# Altium schematic sheet sensors.SchDoc
size A4
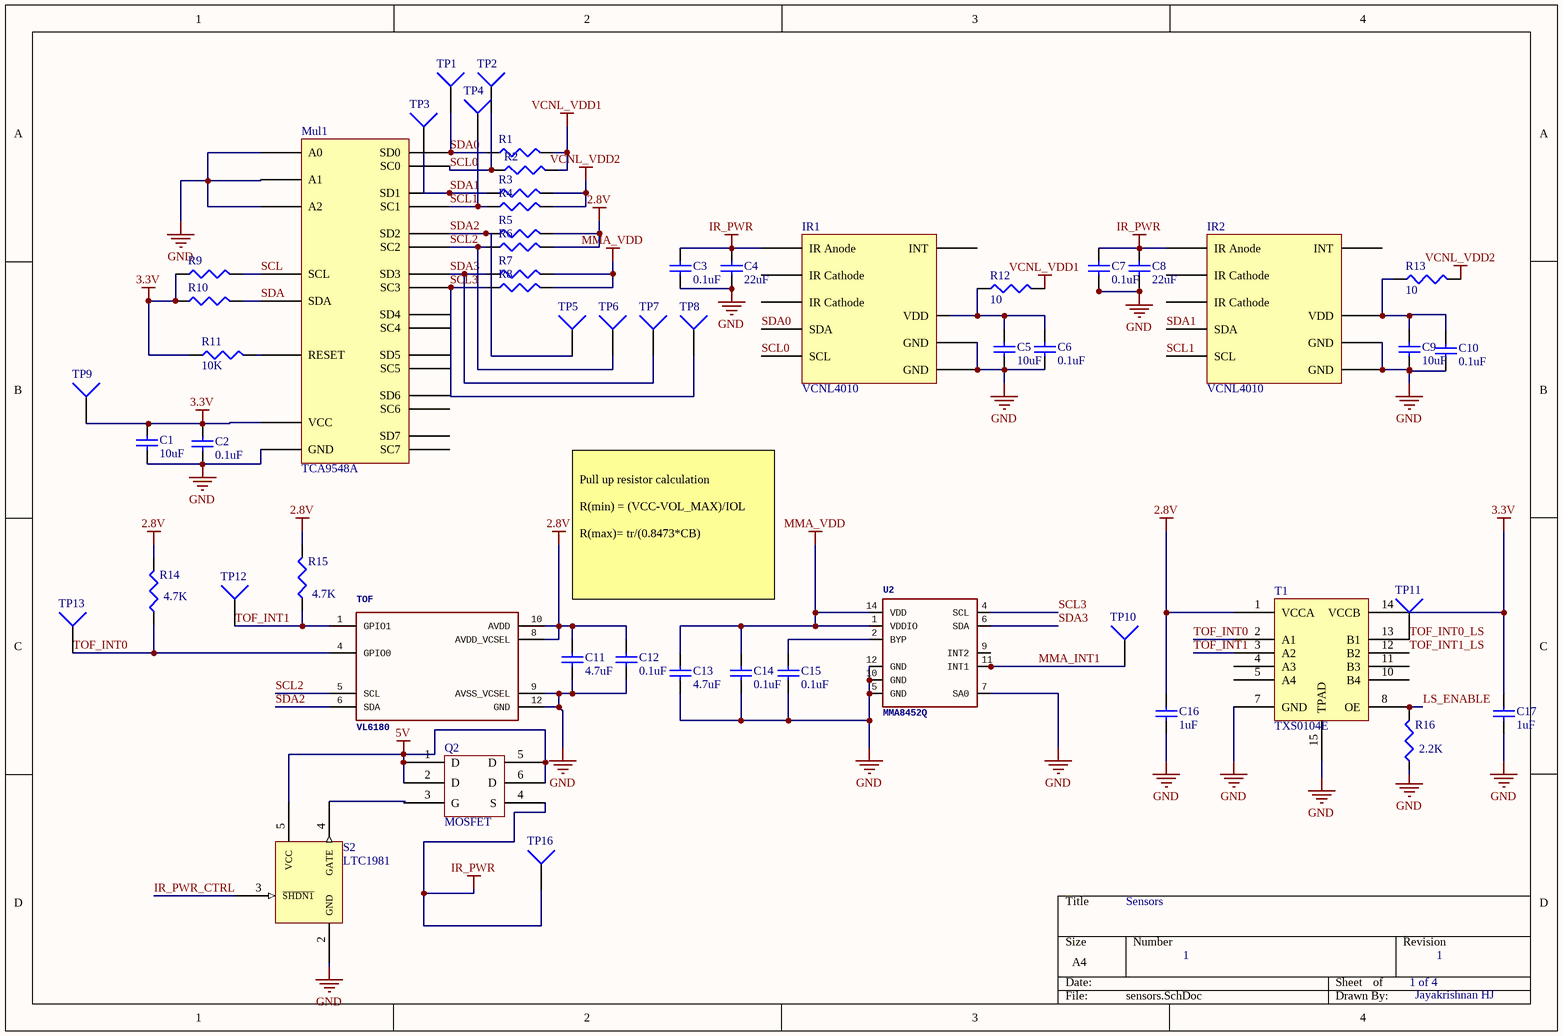
[diagram p0: sensors.SchDoc]

## Parts
C1  value 10uF  [1608[0603]]  (hidden comment: Cap Semi)
C2  value 0.1uF  [1608[0603]]  (hidden comment: Cap Semi)
C3  value 0.1uF  [1608[0603]]  (hidden comment: Cap Semi)
C4  value 22uF  [1608[0603]]  (hidden comment: Cap Semi)
C5  value 10uF  [1608[0603]]  (hidden comment: Cap Semi)
C6  value 0.1uF  [1608[0603]]  (hidden comment: Cap Semi)
C7  value 0.1uF  [1608[0603]]  (hidden comment: Cap Semi)
C8  value 22uF  [1608[0603]]  (hidden comment: Cap Semi)
C9  value 10uF  [1608[0603]]  (hidden comment: Cap Semi)
C10  value 0.1uF  [1608[0603]]  (hidden comment: Cap Semi)
C11  value 4.7uF  [1608[0603]]  (hidden comment: Cap Semi)
C12  value 0.1uF  [1608[0603]]  (hidden comment: Cap Semi)
C13  value 4.7uF  [1608[0603]]  (hidden comment: Cap Semi)
C14  value 0.1uF  [1608[0603]]  (hidden comment: Cap Semi)
C15  value 0.1uF  [1608[0603]]  (hidden comment: Cap Semi)
C16  value 1uF  [1608[0603]]  (hidden comment: Cap Semi)
C17  value 1uF  [1608[0603]]  (hidden comment: Cap Semi)
IR1  VCNL4010  [13-WQFN]
IR2  VCNL4010  [13-WQFN]
Mul1  TCA9548A  [TTSOP MULTIPLEXER]
Q2  MOSFET  [MOSFET SI3442]
R1  Res3  [J1-0603]  (value not drawn)
R2  Res3  [J1-0603]  (value not drawn)
R3  Res3  [J1-0603]  (value not drawn)
R4  Res3  [J1-0603]  (value not drawn)
R5  Res3  [J1-0603]  (value not drawn)
R6  Res3  [J1-0603]  (value not drawn)
R7  Res3  [J1-0603]  (value not drawn)
R8  Res3  [J1-0603]  (value not drawn)
R9  Res3  [J1-0603]  (value not drawn)
R10  Res3  [J1-0603]  (value not drawn)
R11  value 10K  [J1-0603]  (hidden comment: Res3)
R12  value 10  [J1-0603]  (hidden comment: Res3)
R13  value 10  [J1-0603]  (hidden comment: Res3)
R14  value 4.7K  [1608[0603]]  (hidden comment: Res3)
R15  value 4.7K  [1608[0603]]  (hidden comment: Res3)
R16  value 2.2K  [J1-0603]  (hidden comment: Res3)
S2  LTC1981  [LTC1981]
T1  TXS0104E  [txs0104e]
TOF  VL6180  [VL6180]
TP1  Socket  [PIN1]  (value not drawn)
TP2  Socket  [PIN1]  (value not drawn)
TP3  Socket  [PIN1]  (value not drawn)
TP4  Socket  [PIN1]  (value not drawn)
TP5  Socket  [PIN1]  (value not drawn)
TP6  Socket  [PIN1]  (value not drawn)
TP7  Socket  [PIN1]  (value not drawn)
TP8  Socket  [PIN1]  (value not drawn)
TP9  Socket  [PIN1]  (value not drawn)
TP10  Socket  [PIN1]  (value not drawn)
TP11  Socket  [PIN1]  (value not drawn)
TP12  Socket  [PIN1]  (value not drawn)
TP13  Socket  [PIN1]  (value not drawn)
TP16  Socket  [PIN1]  (value not drawn)
U2  MMA8452Q  [MMA8452Q_jk]

## Nets
2.8V: C11.2 C12.2 C16.2 R5.2 R6.2 R14.2 R15.2 T1.1(VCCA) TOF.8(AVDD_VCSEL) TOF.10(AVDD)
3.3V: C1.2 C2.2 C17.2 Mul1.24(VCC) R9.1 R10.1 R11.1 T1.14(VCCB) TP9.1
5V: Q2.1(D) Q2.2(D) Q2.5(D) Q2.6(D) S2.5(VCC)
GND: C1.1 C2.1 C3.1 C4.1 C5.1 C6.1 C7.1 C8.1 C9.1 C10.1 C11.1 C12.1 C13.1 C14.1 C15.1 C16.1 C17.1 IR1.12(GND) IR1.13(GND) IR2.12(GND) IR2.13(GND) Mul1.1(A0) Mul1.2(A1) Mul1.12(GND) Mul1.21(A2) R16.1 S2.2(GND) T1.7(GND) T1.15(TPAD) TOF.9(AVSS_VCSEL) TOF.12(GND) U2.5(GND) U2.7(SA0) U2.10(GND) U2.12(GND)
IR_PWR: C3.2 C4.2 C7.2 C8.2 IR1.1(IR_Anode) IR2.1(IR_Anode) Q2.4(S) TP16.1
MMA_VDD: C13.2 C14.2 R7.2 R8.2 U2.1(VDDIO) U2.14(VDD)
VCNL_VDD1: R1.2 R2.2 R12.2
VCNL_VDD2: R3.2 R4.2 R13.2
IR_PWR_CTRL: S2.3(~{SHDN1})
LS_ENABLE: R16.2 T1.8(OE)
MMA_INT1: TP10.1 U2.11(INT1)
SCL: Mul1.22(SCL) R9.2
SCL0: IR1.5(SCL) Mul1.5(SC0) R2.1 TP2.1
SCL1: IR2.5(SCL) Mul1.7(SC1) R4.1 TP4.1
SCL2: Mul1.9(SC2) R6.1 TOF.5(SCL) TP6.1
SCL3: Mul1.11(SC3) R8.1 TP8.1 U2.4(SCL)
SDA: Mul1.23(SDA) R10.2
SDA0: IR1.4(SDA) Mul1.4(SD0) R1.1 TP1.1
SDA1: IR2.4(SDA) Mul1.6(SD1) R3.1 TP3.1
SDA2: Mul1.8(SD2) R5.1 TOF.6(SDA) TP5.1
SDA3: Mul1.10(SD3) R7.1 TP7.1 U2.6(SDA)
TOF_INT0: R14.1 T1.2(A1) TOF.4(GPIO0) TP13.1
TOF_INT0_LS: T1.13(B1) TP11.1
TOF_INT1: R15.1 T1.3(A2) TOF.1(GPIO1) TP12.1
TOF_INT1_LS: T1.12(B2)
NetC5_2: C5.2 C6.2 IR1.7(VDD) R12.1
NetC9_2: C9.2 C10.2 IR2.7(VDD) R13.1
NetC15_2: C15.2 U2.2(BYP)
NetMul1_3: Mul1.3(RESET) R11.2
NetQ2_3: Q2.3(G) S2.4(GATE)

Not connected (* = marked no-connect by the designer): IR1 2(IR_Cathode) 3(IR_Cathode) 6(INT); IR2 2(IR_Cathode) 3(IR_Cathode) 6(INT); Mul1 13(SD4) 14(SC4) 15(SD5) 16(SC5) 17(SD6) 18(SC6) 19(SD7) 20(SC7); T1 4(A3) 5(A4) 10(B4) 11(B3); U2 9(INT2)

## Notes on the sheet
- Pull up resistor calculation
  R(min) = (VCC-VOL_MAX)/IOL
  R(max)= tr/(0.8473*CB)
- Sensors
- 1
- 1 of 4
- Jayakrishnan HJ

## Library data of the parts
C1 C5 C9 = Cap Semi: CAP CER 10UF 10V X5R 0603; Manufacturer: Murata Electronics North America; Manufacturer Part Number: GRM188R61A106KE69D; ComponentLink1Description: Datasheet; ComponentLink1URL: http://search.murata.co.jp/Ceramy/image/img/A01X/partnumbering_e_01.pdf; Digikey Part No: 490-10474-1-ND
C2 C3 C6 C7 C10 C12 C14 C15 = Cap Semi: CAP CER 0.1UF 10V X7R 0603; Manufacturer: KEMET; Manufacturer Part Number: C0603C104K8RACTU; ComponentLink1Description: Datasheet; ComponentLink1URL: http://www.kemet.com/Lists/ProductCatalog/Attachments/53/KEM_C1002_X7R_SMD.pdf; Digikey Part No: 399-1095-1-ND
C4 C8 = Cap Semi: CAP CER 22UF 6.3V X5R 0603; Manufacturer: Murata Electronics North America; Manufacturer Part Number: GRM188R60J226MEA0D; ComponentLink1Description: Datasheet; ComponentLink1URL: http://search.murata.co.jp/Ceramy/image/img/A01X/partnumbering_e_01.pdf; Digikey Part No: 490-7611-1-ND
C11 C13 = Cap Semi: CAP CER 4.7UF 10V X5R 0603; Manufacturer: Murata Electronics North America; Manufacturer Part Number: GRM188R61A475KE15D; ComponentLink1Description: Datasheet; ComponentLink1URL: http://search.murata.co.jp/Ceramy/image/img/A01X/partnumbering_e_01.pdf; Digikey Part No: 490-10477-1-ND
C16 C17 = Cap Semi: CAP CER 1UF 10V X7R 0603; Manufacturer: Samsung Electro-Mechanics America, Inc.; Manufacturer Part Number: CL10B105KP8NNNC; ComponentLink1Description: Datasheet; ComponentLink1URL: http://www.digikey.com/product-detail/en/samsung-electro-mechanics-america-inc/CL10B105KP8NNNC/1276-1946-1-ND/3890032; Digikey Part No: 1276-1946-1-ND
IR1 = VCNL4010: SENS IR PROXIMITY AMB LT 12LLP; Manufacturer: Vishay Semiconductor Opto Division; Manufacturer Part Number: VCNL4010-GS08; Digikey Part Number: VCNL4010-GS08CT-ND; ComponentLink1Description: Datasheet; ComponentLink1URL: https://www.digikey.com/products/en/sensors-transducers/optical-sensors-ambient-light-ir-uv-sensors/536?k=vcnl+4010&k=&pkeyword=vcnl+4010&pv7=2&pv16=14926&FV=ffe00218&mnonly=0&newproducts=0&ColumnSort=0&page=1&quantity=0&ptm=0&fid=0&pageSize=25; Value: *
IR2 = VCNL4010: SENS IR PROXIMITY AMB LT 12LLP; Manufacturer Part Number: VCNL4010-GS08; Manufacturer: Vishay Semiconductor Opto Division; ComponentLink1Description: link; Digikey Part No: VCNL4010-GS08CT-ND; ComponentLink1URL: https://www.digikey.com/products/en/sensors-transducers/optical-sensors-ambient-light-ir-uv-sensors/536?k=vcnl+4010&k=&pkeyword=vcnl+4010&pv7=2&pv16=14926&FV=ffe00218&mnonly=0&newproducts=0&ColumnSort=0&page=1&quantity=0&ptm=0&fid=0&pageSize=25
Mul1 = TCA9548A: IC I2C SW 8CH W/RESET 24TSSOP; Manufacturer: Texas Instruments; Manufacturer Part Number: TCA9548APWR; Digikey Part Number: 296-34905-1-ND; ComponentLink1Description: LINK; ComponentLink1URL: https://www.digikey.com/products/en/integrated-circuits-ics/logic-signal-switches-multiplexers-decoders/743?k=tca9548a&k=&pkeyword=tca9548a&pv7=2&pv1291=24&FV=ffe002e7&mnonly=0&newproducts=0&ColumnSort=0&page=1&quantity=0&ptm=0&fid=0&pageSize=25; Value: *
Q2 = MOSFET: MOSFET N-CH 20V 3A 6-TSOP; Manufacturer Part Number: SI3442BDV-T1-E3; Manufacturer: Vishay Siliconix; ComponentLink1URL: https://www.digikey.com/product-detail/en/vishay-siliconix/SI3442BDV-T1-E3/SI3442BDV-T1-E3CT-ND/1656865; Digikey Part No: SI3442BDV-T1-E3CT-ND; Value: *; ComponentLink1Description: link
R1-R10 R14 R15 = Res3: RES SMD 4.7K OHM 5% 1/10W 0603; Manufacturer: Yageo; Manufacturer Part Number: RC0603JR-074K7L; ComponentLink1URL: http://www.digikey.com/product-detail/en/yageo/RC0603JR-074K7L/311-4.7KGRCT-ND/729732; ComponentLink1Description: Datasheet; Digikey Part No: 311-4.7KGRCT-ND
  R1-R10: Value: 4.7K
R11 = Res3: RES SMD 10K OHM 5% 1/16W 0402; Manufacturer: Yageo; Manufacturer Part Number: RC0402JR-0710KL; ComponentLink1URL: http://www.digikey.com/product-detail/en/yageo/RC0402JR-0710KL/311-10KJRCT-ND/729365; ComponentLink1Description: Datasheet; Digikey Part No: 311-10KJRCT-ND
R12 R13 = Res3: RES SMD 10 OHM 1% 1/10W 0603; Manufacturer: Yageo; Manufacturer Part Number: RC0603FR-0710RL; ComponentLink1URL: http://www.digikey.com/product-detail/en/yageo/RC0603FR-0710RL/311-10.0HRCT-ND/729826; ComponentLink1Description: Datasheet; Digikey Part No: 311-10.0HRCT-ND
R16 = Res3: RES SMD 2.2K OHM 1% 1/16W 0402; Manufacturer: Yageo; Manufacturer Part Number: RC0402FR-072K2L; ComponentLink1URL: http://www.digikey.com/product-detail/en/yageo/RC0402FR-072K2L/311-2.20KLRCT-ND/729500; ComponentLink1Description: Datasheet; Digikey Part No: 311-2.20KLRCT-ND
S2 = LTC1981: IC HI-SIDE SW CTRL SNGL TSOT23-5; Manufacturer Part Number: LTC1981ES5#TRMPBF; Manufacturer: Linear Technology; ComponentLink1Description: link; ComponentLink1URL: https://www.digikey.com/products/en/integrated-circuits-ics/pmic-gate-drivers/730?k=ltc1981&k=&pkeyword=ltc1981&pv7=2&mnonly=0&newproducts=0&ColumnSort=0&page=1&quantity=0&ptm=0&fid=0&pageSize=25; Value: *; Digikey Part No: LTC1981ES5#TRMPBFCT-ND
T1 = TXS0104E: IC 4BIT NON-INV TRANSLTR 14-QFN; Manufacturer Part Number: TXS0104ERGYR; Manufacturer: Texas Instruments; Value: *; ComponentLink1Description: link; ComponentLink1URL: https://www.digikey.com/product-detail/en/texas-instruments/TXS0104ERGYR/296-20698-1-ND/1143682; Digikey Part No: 296-20698-1-ND
TOF = VL6180: MOD TIME-OF-FLIGHT 3IN1 12LGA; Manufacturer: STMicroelectronics; Manufacturer Part Number: VL6180XV0NR/1; Digikey Part No: 497-14702-1-ND; ComponentLink1Description: link; Value: *; ComponentLink1URL: https://www.digikey.com/product-detail/en/stmicroelectronics/VL6180XV0NR-1/497-14702-1-ND/4854910
U2 = MMA8452Q: ACCELEROMETER 2-8G I2C 16QFN; Manufacturer: NXP USA Inc.; Manufacturer Part Number: MMA8452QR1; ComponentLink1URL: https://www.digikey.com/products/en/sensors-transducers/motion-sensors-accelerometers/515?k=mma8452Q&k=&pkeyword=mma8452Q&pv7=2&FV=ffe00203&mnonly=0&newproducts=0&ColumnSort=0&page=1&quantity=0&ptm=0&fid=0&pageSize=25; ComponentLink1Description: link; Digikey Part No: MMA8452QR1CT-ND; Value: *
TP1-TP13 TP16 = Socket: LatestRevisionDate: 17-Jul-2002; LatestRevisionNote: Re-released for DXP Platform.; Publisher: Altium Limited